# Altium schematic sheet PowerSupply.SchDoc
size A4; SheetNumber: 5; SheetTotal: 5
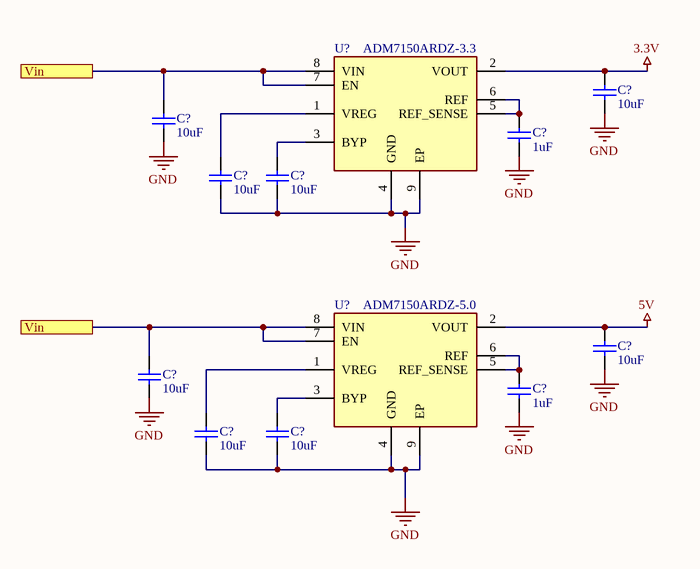
[diagram p0: PowerSupply.SchDoc]

## Parts
(Parts that share a designator on the sheet are numbered #1, #2 ... from top to bottom, then left to right.)
C?#1  10uF  [CAP_0402]
C?#2  10uF  [CAP_0402]
C?#3  1uF  [CAP_0402]
C?#4  10uF  [CAP_0402]
C?#5  10uF  [CAP_0402]
C?#6  10uF  [CAP_0402]
C?#7  10uF  [CAP_0402]
C?#8  1uF  [CAP_0402]
C?#9  10uF  [CAP_0402]
C?#10  10uF  [CAP_0402]
U?#1  ADM7150ARDZ-3.3  [SOIC127P600X175-9N]
U?#2  ADM7150ARDZ-5.0  [SOIC127P600X175-9N]

## Ports
Vin

## Nets
3.3V: C?#1.2 U?#1.2(VOUT)
5V: C?#6.2 U?#2.2(VOUT)
GND: C?#1.1 C?#2.1 C?#3.1 C?#4.1 C?#5.1 C?#6.1 C?#7.1 C?#8.1 C?#9.1 C?#10.1 U?#1.4(GND) U?#1.9(EP) U?#2.4(GND) U?#2.9(EP)
Vin: C?#2.2 C?#7.2 U?#1.7(EN) U?#1.8(VIN) U?#2.7(EN) U?#2.8(VIN) ; port Vin
NetC?#3_2: C?#3.2 U?#1.5(REF_SENSE) U?#1.6(REF)
NetC?#4_2: C?#4.2 U?#1.1(VREG)
NetC?#5_2: C?#5.2 U?#1.3(BYP)
NetC?#8_2: C?#8.2 U?#2.5(REF_SENSE) U?#2.6(REF)
NetC?#9_2: C?#9.2 U?#2.1(VREG)
NetC?#10_2: C?#10.2 U?#2.3(BYP)

## Library data of the parts
C?#1-C?#10 = Capacitor: Manufacturer: Murata; Part Number: GRM155R71E103KA01D
U?#1 = ADM7150ARDZ-3.3: Integrated Circuit; Manufacturer_Name: Analog Devices; Datasheet Link: https://www.analog.com/media/en/technical-documentation/data-sheets/ADM7150.pdf; Height: 1.75mm; Manufacturer_Part_Number: ADM7150ARDZ-3.3; Mouser Part Number: 584-ADM7150ARDZ-3.3; Mouser Price/Stock: https://www.mouser.co.uk/ProductDetail/Analog-Devices/ADM7150ARDZ-3.3?qs=J50fqX%2Fl9iqu%2FV4kkGpO0w%3D%3D; Arrow Part Number: ADM7150ARDZ-3.3; Arrow Price/Stock: https://www.arrow.com/en/products/adm7150ardz-3.3/analog-devices?region=europe
U?#2 = ADM7150ARDZ-5.0: Integrated Circuit; Manufacturer_Name: Analog Devices; Datasheet Link: http://www.farnell.com/datasheets/2252893.pdf; Height: 1.75mm; Manufacturer_Part_Number: ADM7150ARDZ-5.0; Mouser Part Number: 584-ADM7150ARDZ-5.0; Mouser Price/Stock: https://www.mouser.co.uk/ProductDetail/Analog-Devices/ADM7150ARDZ-5.0?qs=J50fqX%2Fl9irwq1mMDkiaAg%3D%3D; Arrow Part Number: ADM7150ARDZ-5.0; Arrow Price/Stock: https://www.arrow.com/en/products/adm7150ardz-5.0/analog-devices?region=europe